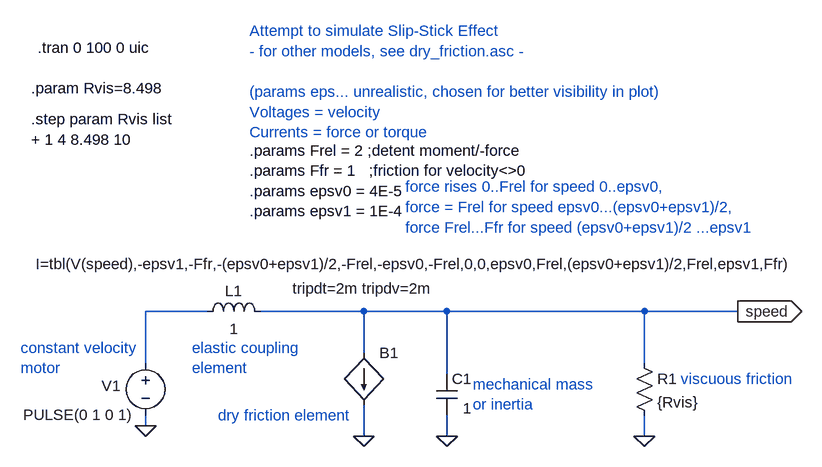
[diagram p0: schematic StickSlip.asc]
StickSlip.asc, the LTspice schematic file:
Version 4
SHEET 1 1216 1008
WIRE -416 320 -416 240
WIRE -416 416 -416 400
WIRE -320 240 -416 240
WIRE -80 240 -240 240
WIRE -80 304 -80 240
WIRE -80 432 -80 384
WIRE 48 240 -80 240
WIRE 48 336 48 240
WIRE 48 432 48 400
WIRE 352 240 48 240
WIRE 352 320 352 240
WIRE 352 432 352 400
WIRE 496 240 352 240
FLAG -416 416 0
FLAG -80 432 0
FLAG 48 432 0
FLAG 496 240 speed
IOPIN 496 240 Out
FLAG 352 432 0
SYMBOL cap 32 336 R0
WINDOW 3 41 53 Left 0
SYMATTR Value 1
SYMATTR InstName C1
SYMBOL voltage -416 304 R0
WINDOW 0 -53 66 Bottom 0
WINDOW 3 -104 80 Top 0
WINDOW 123 0 0 Left 0
WINDOW 39 0 0 Left 0
SYMATTR InstName V1
SYMATTR Value PULSE(0 1 0 1)
SYMBOL ind -336 256 R270
WINDOW 0 32 56 VTop 0
WINDOW 3 5 56 VBottom 0
SYMATTR InstName L1
SYMATTR Value 1
SYMBOL res 336 304 R0
SYMATTR InstName R1
SYMATTR Value {Rvis}
SYMBOL bi -80 304 R0
WINDOW 3 -505 -137 Left 0
WINDOW 123 -110 -99 Left 0
SYMATTR Value I=tbl(V(speed),-epsv1,-Ffr,-(epsv0+epsv1)/2,-Frel,-epsv0,-Frel,0,0,epsv0,Frel,(epsv0+epsv1)/2,Frel,epsv1,Ffr)
SYMATTR Value2 tripdt=2m tripdv=2m
SYMATTR InstName B1
TEXT -582 -166 Left 0 !.tran 0 100 0 uic
TEXT -256 -192 Left 0 ;Attempt to simulate Slip-Stick Effect\n- for other models, see dry_friction.asc -\n \n(params eps... unrealistic, chosen for better visibility in plot)\nVoltages = velocity\nCurrents = force or torque
TEXT -256 -8 Left 0 !.params Frel = 2 ;detent moment/-force\n.params Ffr = 1   ;friction for velocity<>0\n.params epsv0 = 4E-5\n.params epsv1 = 1E-4
TEXT -608 296 Left 0 ;constant velocity\nmotor
TEXT -344 296 Left 0 ;elastic coupling\nelement
TEXT 88 352 Left 0 ;mechanical mass\nor inertia
TEXT -304 400 Left 0 ;dry friction element
TEXT -592 -104 Left 0 !.param Rvis=8.498
TEXT 408 344 Left 0 ;viscuous friction
TEXT -16 48 Left 0 ;force rises 0..Frel for speed 0..epsv0,\nforce = Frel for speed epsv0...(epsv0+epsv1)/2,\nforce Frel...Ffr for speed (epsv0+epsv1)/2 ...epsv1
TEXT -592 -56 Left 0 !.step param Rvis list\n+ 1 4 8.498 10

The netlist it stands for:
* StickSlip.asc
C1 speed 0 1
V1 N001 0 PULSE(0 1 0 1)
L1 N001 speed 1
R1 speed 0 {Rvis}
B1 speed 0 I=tbl(V(speed),-epsv1,-Ffr,-(epsv0+epsv1)/2,-Frel,-epsv0,-Frel,0,0,epsv0,Frel,(epsv0+epsv1)/2,Frel,epsv1,Ffr) tripdt=2m tripdv=2m
.tran 0 100 0 uic
* Attempt to simulate Slip-Stick Effect
* - for other models, see dry_friction.asc -
* (params eps... unrealistic, chosen for better visibility in plot)
* Voltages = velocity
* Currents = force or torque
.params Frel = 2 ;detent moment/-force
.params Ffr = 1   ;friction for velocity<>0
.params epsv0 = 4E-5
.params epsv1 = 1E-4
* constant velocity
* motor
* elastic coupling
* element
* mechanical mass
* or inertia
* dry friction element
.param Rvis=8.498
* viscuous friction
* force rises 0..Frel for speed 0..epsv0,
* force = Frel for speed epsv0...(epsv0+epsv1)/2,
* force Frel...Ffr for speed (epsv0+epsv1)/2 ...epsv1
.step param Rvis list
+ 1 4 8.498 10
.backanno
.end